# Altium schematic sheet Power Supply.SchDoc
size A4
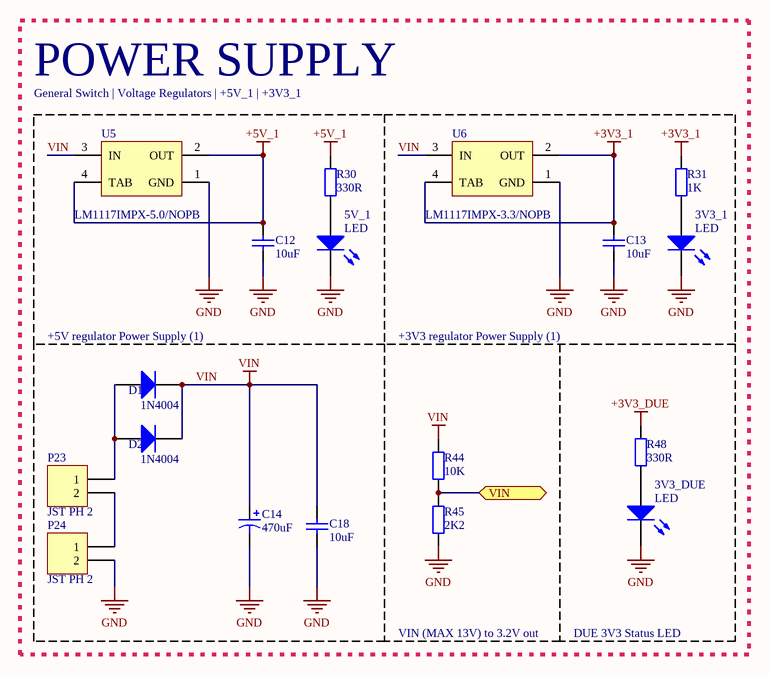
[diagram p0: Power Supply.SchDoc]

## Parts
3V3_1  LED  [LED0805]
3V3_DUE  LED  [LED0805]
5V_1  LED  [LED0805]
C12  10uF  [C1206]
C13  10uF  [C1206]
C14  470uF  [CAPPR3.5-8X11.5]
C18  10uF  [C1206]
D1  1N4004  [DIODESMA]
D2  1N4004  [DIODESMA]
P23  JST PH 2  [B2B-PH-K]
P24  JST PH 2  [B2B-PH-K]
R30  330R  [RES1206]
R31  1K  [RES1206]
R44  10K  [RES1206]
R45  2K2  [RES1206]
R48  330R  [RES1206]
U5  LM1117IMPX-5.0/NOPB  [MP04A_N]
U6  LM1117IMPX-3.3/NOPB  [MP04A_N]

## Ports
VIN

## Nets
+3V3_1: C13.2 R31.2 U6.2(OUT) U6.4(TAB)
+3V3_DUE: R48.2
+5V_1: C12.2 R30.2 U5.2(OUT) U5.4(TAB)
GND: 3V3_1.2(K) 3V3_DUE.2(K) 5V_1.2(K) C12.1 C13.1 C14.2 C18.1 P24.2 R45.1 U5.1(GND) U6.1(GND)
VIN: C14.1 C18.2 D1.1(K) D2.1(K) R44.2 U5.3(IN) U6.3(IN)
VIN: R44.1 R45.2 ; port VIN  [a separate net that carries the same name]
Net3V3_1_1: 3V3_1.1(A) R31.1
Net3V3_DUE_1: 3V3_DUE.1(A) R48.1
Net5V_1_1: 5V_1.1(A) R30.1
NetD1_2: D1.2(A) D2.2(A) P23.1
NetP23_2: P23.2 P24.1

## Notes on the sheet
- POWER SUPPLY
- General Switch | Voltage Regulators | +5V_1 | +3V3_1
- (near D1) +5V regulator Power Supply (1)
- +3V3 regulator Power Supply (1)
- VIN (MAX 13V) to 3.2V out
- DUE 3V3 Status LED

## Library data of the parts
C12 C13 C18 = Cap Semi: Capacitor (Semiconductor SIM Model); Published: 8-Jun-2000; LatestRevisionDate: 29-May-2009; LatestRevisionNote: IPC-7351 Footprint Added.; PackageReference: C1206; Publisher: Altium Limited; PackageDescription: Chip Capacitor; Value: 10uF
C14 = EKA00PB310J00: Aluminum Electrolytic Capacitor, Radial Style with Long Leads: 100uF, 63V; Note: Refer to Manufacturer's Data Sheets for other lead formations; DrillSize: Nominal, Rounded To The Nearest 0.1mm; Published: 19-Mar-2004; DatasheetDocument: 20-Feb-2001; PackageReference: CAPPR3.5-8X11.5; Publisher: Altium Limited; ComponentLink1Description: Manufacturer Link; ComponentLink1URL: http://www.vishay.com/; ComponentLink2Description: Datasheet; ComponentLink2URL: http://www.vishay.com/docs/25014/eka.pdf; Value: 100uF
D1 D2 = DIODE
R30 R31 R44 R45 R48 = RES
U5 = LM1117IMPX-5.0/NOPB: 800mA Low-Dropout Linear Regulator, 4-pin SOT-223, Pb-Free; Manufacturer: National Semiconductor; PackageTopMarking: XYTT*N06B; PowerWise: N; CompType: LDO IC; Published: 1-Mar-2010; DatasheetVersion: Apr-2006; PackageVersion: revB, Apr-2003; PackageReference: MP04A; Publisher: Altium Limited; PackageDescription: Molded SOT-223, 6.50 x 3.56 x 1.6mm Body, 4 Lead, 2.3mm Pitch; Supplier 1: Digi-Key; Supplier Part Number 1: LM1117IMPX-5.0-ND; PartNumber: LM1117IMPX-5.0/NOPB; RoHS: Y; PinCount: 4; Code_JEDEC: TO-261-AA; Code_IPC: SOT223-4; ComponentLink1Description: LM1117 Datasheet; ComponentLink1URL: http://www.national.com/ds/LM/LM1117.pdf; ComponentLink2Description: LM1117 Web Page; ComponentLink2URL: http://www.national.com/pf/LM/LM1117.html; ComponentLink3Description: MP04A Package Page; ComponentLink3URL: http://www.national.com/packaging/folders/mp04a.html
U6 = LM1117IMPX-3.3/NOPB: 800mA Low-Dropout Linear Regulator, 4-pin SOT-223, Pb-Free; Manufacturer: National Semiconductor; PackageTopMarking: XYTT*N05B; PowerWise: N; CompType: LDO IC; Published: 1-Mar-2010; DatasheetVersion: Apr-2006; PackageVersion: revB, Apr-2003; PackageReference: MP04A; Publisher: Altium Limited; PackageDescription: Molded SOT-223, 6.50 x 3.56 x 1.6mm Body, 4 Lead, 2.3mm Pitch; Supplier 1: Digi-Key; Supplier Part Number 1: LM1117IMPX-3.3-ND; PartNumber: LM1117IMPX-3.3/NOPB; RoHS: Y; PinCount: 4; Code_JEDEC: TO-261-AA; Code_IPC: SOT223-4; ComponentLink1Description: LM1117 Datasheet; ComponentLink1URL: http://www.national.com/ds/LM/LM1117.pdf; ComponentLink2Description: LM1117 Web Page; ComponentLink2URL: http://www.national.com/pf/LM/LM1117.html; ComponentLink3Description: MP04A Package Page; ComponentLink3URL: http://www.national.com/packaging/folders/mp04a.html